# EAGLE schematic address_decoding_rw_8bytes (EAGLE 7.2.0)
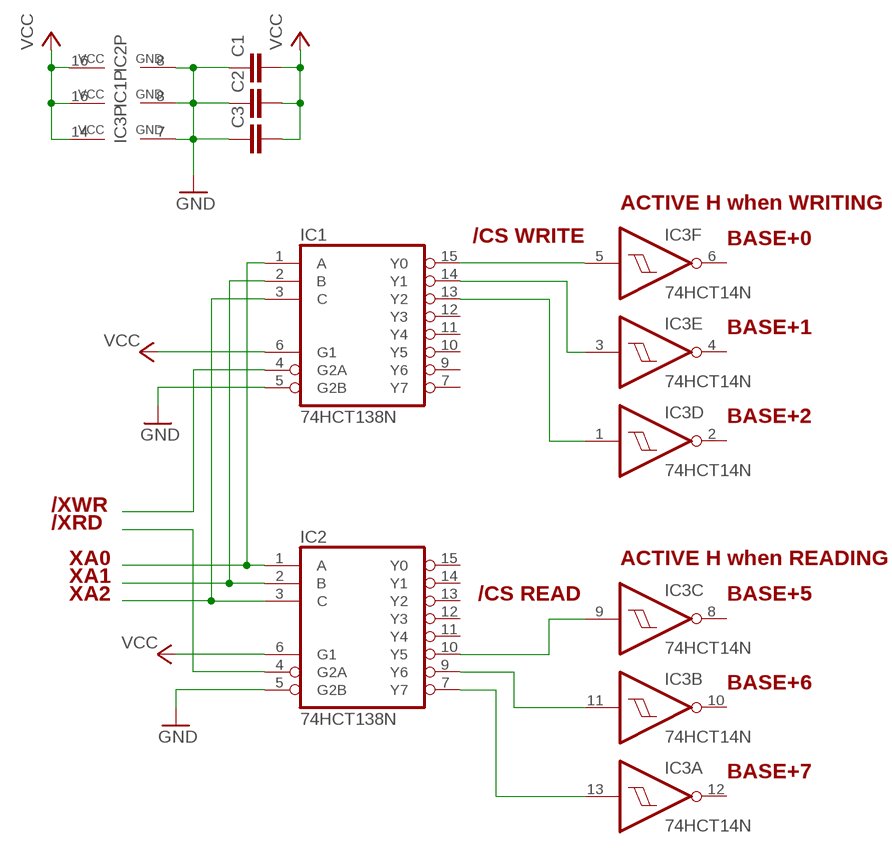
[diagram p0: schematic, sheet 1]

## Parts
C1  C-EU025-024X044  [C025-024X044]
C2  C-EU025-024X044  [C025-024X044]
C3  C-EU025-024X044  [C025-024X044]
IC1  74HCT138N  [DIL16]
IC2  74HCT138N  [DIL16]
IC3  74HCT14N  [DIL14]

## Nets
GND: C1.1 C2.1 C3.1 IC1.5(G2B) IC1.8(GND) IC2.5(G2B) IC2.8(GND) IC3.7(P:GND)
N$1: IC1.1(A) IC2.1(A)
N$2: IC1.2(B) IC2.2(B)
N$3: IC1.3(C) IC2.3(C)
N$4: IC2.7(Y7) IC3.13(A:I)
N$5: IC2.9(Y6) IC3.11(B:I)
N$6: IC1.15(Y0) IC3.5(F:I)
N$7: IC1.14(Y1) IC3.3(E:I)
N$8: IC1.13(Y2) IC3.1(D:I)
N$9: IC2.10(Y5) IC3.9(C:I)
N$10: IC2.4(G2A)
N$11: IC1.4(G2A)
VCC: C1.2 C2.2 C3.2 IC1.6(G1) IC1.16(VCC) IC2.6(G1) IC2.16(VCC) IC3.14(P:VCC)
Unconnected: IC1.7(Y7) IC1.9(Y6) IC1.10(Y5) IC1.11(Y4) IC1.12(Y3) IC2.11(Y4) IC2.12(Y3) IC2.13(Y2) IC2.14(Y1) IC2.15(Y0) IC3.2(D:O) IC3.4(E:O) IC3.6(F:O) IC3.8(C:O) IC3.10(B:O) IC3.12(A:O)

## Notes on the sheet
- ACTIVE H when WRITING
- /CS WRITE
- BASE+0
- BASE+1
- BASE+2
- /XWR
- /XRD
- XA0 | ACTIVE H when READING
- XA1
- XA2 | /CS READ | BASE+5
- BASE+6
- BASE+7

## Library data of the parts
C1-C3 = rcl:C-EU: CAPACITOR, European symbol
IC1 IC2 = 74xx-eu:74*138: 3-line to 8-line DECODER/DEMULTIPLEXER
IC3 = 74xx-eu:74*14: Hex schmitt trigger INVERTER